# EAGLE design signal_interface_opamp_buffer (EAGLE 6.5.0)
Signal Interfacing Board
AUTHOR: Pasakorn Tiwatthanont; REV: 1
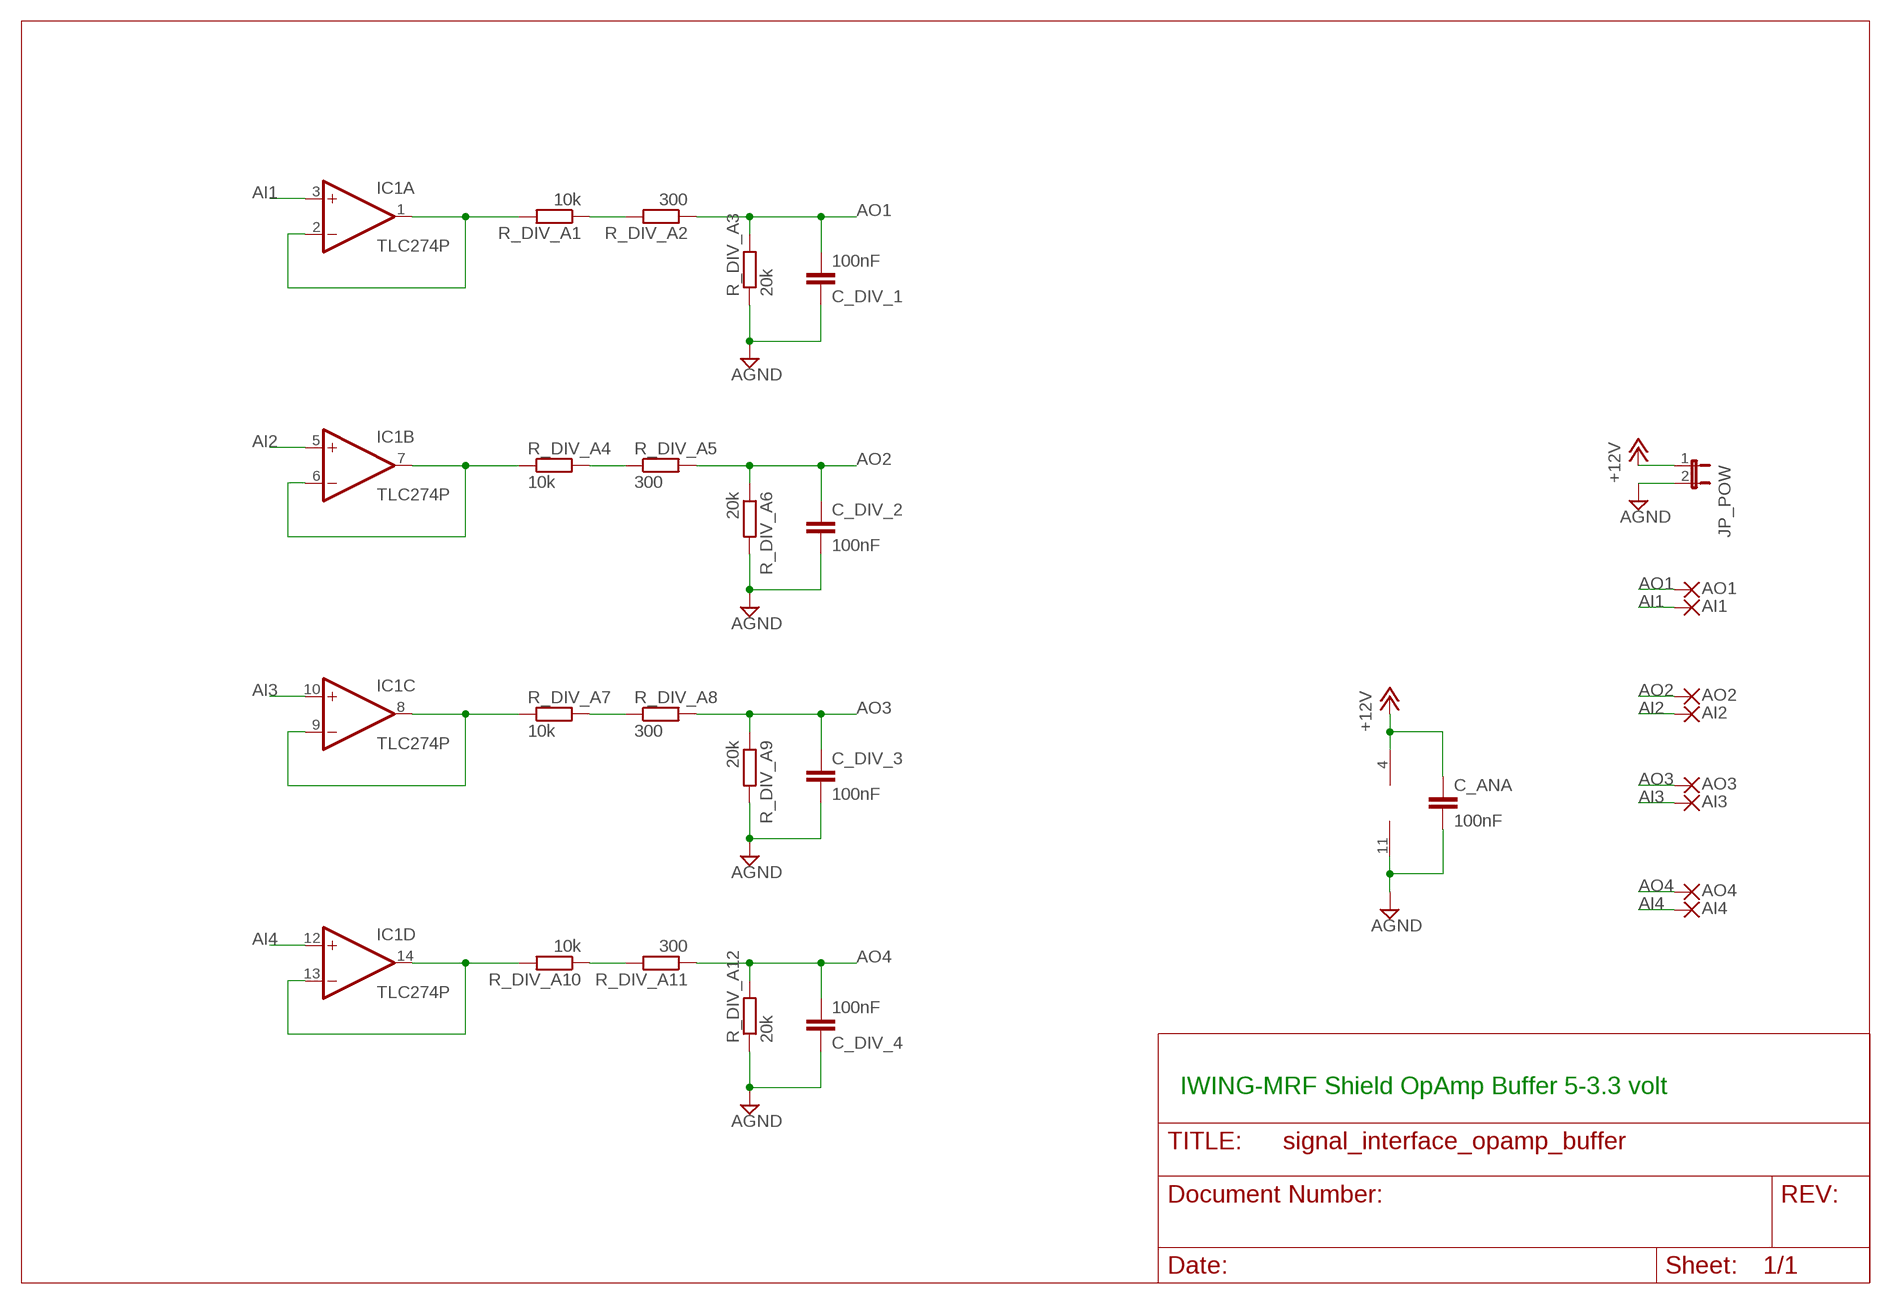
[diagram p0: schematic, sheet 1]

## Parts
AI1  WIREPADSMD1,27-254  [SMD1,27-2,54]
AI2  WIREPADSMD1,27-254  [SMD1,27-2,54]
AI3  WIREPADSMD1,27-254  [SMD1,27-2,54]
AI4  WIREPADSMD1,27-254  [SMD1,27-2,54]
AO1  WIREPADSMD1,27-254  [SMD1,27-2,54]
AO2  WIREPADSMD1,27-254  [SMD1,27-2,54]
AO3  WIREPADSMD1,27-254  [SMD1,27-2,54]
AO4  WIREPADSMD1,27-254  [SMD1,27-2,54]
C_ANA  100nF  RCL_C-EU050-025X075  [RCL_C050-025X075]
C_DIV_1  100nF  RCL_C-EU050-025X075  [RCL_C050-025X075]
C_DIV_2  100nF  RCL_C-EU050-025X075  [RCL_C050-025X075]
C_DIV_3  100nF  RCL_C-EU050-025X075  [RCL_C050-025X075]
C_DIV_4  100nF  RCL_C-EU050-025X075  [RCL_C050-025X075]
IC1  TLC274P  [DIL14]
JP_POW  JUMPER-2PTH  [1X02]
R_DIV_A1  10k  R-EU_0204/2V  [0204V]
R_DIV_A2  300  R-EU_0204/2V  [0204V]
R_DIV_A3  20k  R-EU_0204/2V  [0204V]
R_DIV_A4  10k  R-EU_0204/2V  [0204V]
R_DIV_A5  300  R-EU_0204/2V  [0204V]
R_DIV_A6  20k  R-EU_0204/2V  [0204V]
R_DIV_A7  10k  R-EU_0204/2V  [0204V]
R_DIV_A8  300  R-EU_0204/2V  [0204V]
R_DIV_A9  20k  R-EU_0204/2V  [0204V]
R_DIV_A10  10k  R-EU_0204/2V  [0204V]
R_DIV_A11  300  R-EU_0204/2V  [0204V]
R_DIV_A12  20k  R-EU_0204/2V  [0204V]

## Nets
+12V: C_ANA.1 IC1.4(P:V+) JP_POW.1
AGND: C_ANA.2 C_DIV_1.1 C_DIV_2.2 C_DIV_3.2 C_DIV_4.1 IC1.11(P:V-) JP_POW.2 R_DIV_A3.1 R_DIV_A6.2 R_DIV_A9.2 R_DIV_A12.1
AI1: AI1.1(P) IC1.3(A:+IN)
AI2: AI2.1(P) IC1.5(B:+IN)
AI3: AI3.1(P) IC1.10(C:+IN)
AI4: AI4.1(P) IC1.12(D:+IN)
AO1: AO1.1(P) C_DIV_1.2 R_DIV_A2.1 R_DIV_A3.2
AO2: AO2.1(P) C_DIV_2.1 R_DIV_A5.2 R_DIV_A6.1
AO3: AO3.1(P) C_DIV_3.1 R_DIV_A8.2 R_DIV_A9.1
AO4: AO4.1(P) C_DIV_4.2 R_DIV_A11.1 R_DIV_A12.2
N$1: IC1.1(A:OUT) IC1.2(A:-IN) R_DIV_A1.2
N$2: R_DIV_A4.2 R_DIV_A5.1
N$3: R_DIV_A1.1 R_DIV_A2.2
N$4: IC1.6(B:-IN) IC1.7(B:OUT) R_DIV_A4.1
N$5: R_DIV_A7.2 R_DIV_A8.1
N$6: IC1.8(C:OUT) IC1.9(C:-IN) R_DIV_A7.1
N$7: R_DIV_A10.1 R_DIV_A11.2
N$8: IC1.13(D:-IN) IC1.14(D:OUT) R_DIV_A10.2

## Notes on the sheet
- IWING-MRF Shield OpAmp Buffer 5-3.3 volt

## Library data of the parts
AI1-AI4 AO1-AO4 = wirepad:WIREPAD: Wire PAD connect wire on PCB
C_ANA C_DIV_1-C_DIV_4 = ipas:RCL_C-EU: CAPACITOR, European symbol
IC1 = linear:TLC274: OP AMP
JP_POW = SparkFun-Passives:JUMPER-2: Jumper Basic 0.1" spaced jumper. Use with breakaway headers.
R_DIV_A1-R_DIV_A12 = rcl:R-EU_: RESISTOR, European symbol

## Net classes
0 default: width 0.254 mm
1 power: width 0.406 mm, clearance 0.203 mm

## Board
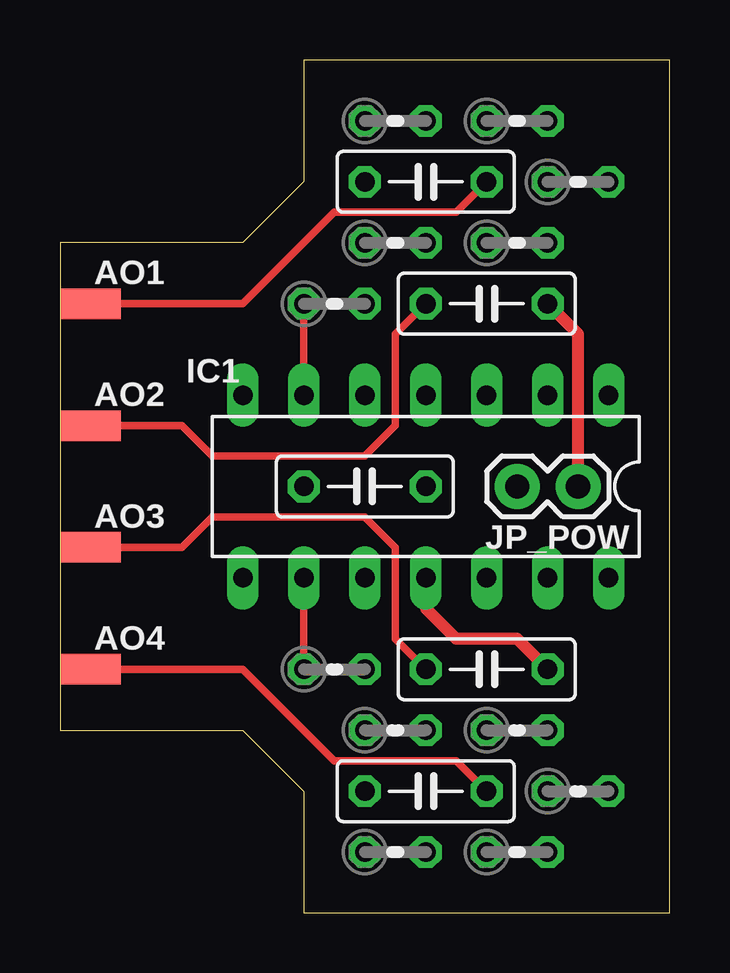
[diagram p1: board, top side]
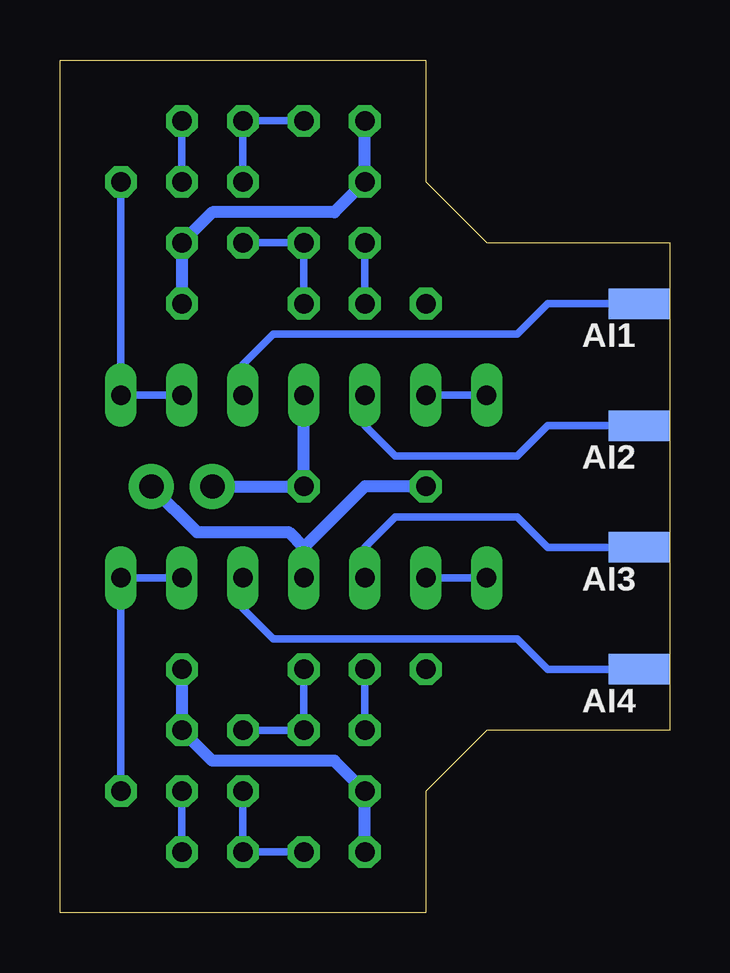
[diagram p2: board, bottom side, seen from below]

Size 25.4 x 35.56 mm. Coordinates in mm from the lower left corner, seen from the top.
Outline: 0,7.62 7.62,7.62 10.16,5.08 10.16,0 25.4,0 25.4,35.56 10.16,35.56 10.16,30.48 7.62,27.94 0,27.94 0,7.62
Copper layers (1*16): Top 0.035mm / dielectric 1.5mm / Bottom 0.035mm
Design rules "default *": minimum track width 12mil, minimum drill 24mil, track to track 12mil, track to pad 12mil, pad to pad 12mil, via to via 12mil, smd to smd 8mil, copper to edge 40mil, drill to drill 8mil, minimum pad ring 10mil, minimum via ring 8mil, stop-mask expansion 4mil, vias tented up to drill 0mil, thermal gap 10mil

### Footprints (pad centres in the part's own frame; a part is rotated, then mirrored left to right if it is on the bottom)
SMD1,27-2,54 = smd 1.27 x 2.54: 1 0,0
RCL_C050-025X075 = drill 0.813 octagon: 1 -2.54,0; 2 2.54,0
DIL14 = drill 0.813 long: 1 -7.62,-3.81; 2 -5.08,-3.81; 3 -2.54,-3.81; 4 0,-3.81; 5 2.54,-3.81; 6 5.08,-3.81; 7 7.62,-3.81; 8 7.62,3.81; 9 5.08,3.81; 10 2.54,3.81; 11 0,3.81; 12 -2.54,3.81; 13 -5.08,3.81; 14 -7.62,3.81
1X02 = drill 1.016 pad 1.88: 1 0,0; 2 2.54,0
0204V = drill 0.813 octagon: 1 -1.27,0; 2 1.27,0

### Placement (x,y rotation side)
AI1  1.27,25.4 90 bottom
AI2  1.27,20.32 90 bottom
AI3  1.27,15.24 90 bottom
AI4  1.27,10.16 90 bottom
AO1  1.27,25.4 270 top
AO2  1.27,20.32 270 top
AO3  1.27,15.24 270 top
AO4  1.27,10.16 270 top
C_ANA  12.7,17.78 180 top
C_DIV_1  15.24,30.48 0 top
C_DIV_2  17.78,25.4 0 top
C_DIV_3  17.78,10.16 0 top
C_DIV_4  15.24,5.08 0 top
IC1  15.24,17.78 180 top
JP_POW  19.05,17.78 0 top
R_DIV_A1  21.59,30.48 0 top
R_DIV_A2  19.05,33.02 0 top
R_DIV_A3  13.97,33.02 0 top
R_DIV_A4  11.43,25.4 0 top
R_DIV_A5  13.97,27.94 0 top
R_DIV_A6  19.05,27.94 0 top
R_DIV_A7  11.43,10.16 0 top
R_DIV_A8  13.97,7.62 0 top
R_DIV_A9  19.05,7.62 0 top
R_DIV_A10  21.59,5.08 0 top
R_DIV_A11  19.05,2.54 0 top
R_DIV_A12  13.97,2.54 0 top

### Tracks (layer width: path | path; a pad name or v marks a point on that pad's centre or on a via)
+12V
  Bottom 0.508: IC1.4 C_ANA.1 JP_POW.1
AGND
  Top 0.508: C_DIV_3.2 19.05,11.43 16.51,11.43 15.24,12.7 IC1.11 | JP_POW.2 21.59,24.13 C_DIV_2.2
  Bottom 0.508: C_DIV_2.2 R_DIV_A6.2 19.05,29.21 13.97,29.21 C_DIV_1.1 R_DIV_A3.1 | C_DIV_3.2 R_DIV_A9.2 19.05,6.35 13.97,6.35 C_DIV_4.1 R_DIV_A12.1 | C_ANA.2 12.7,17.78 15.24,15.24 | 15.24,15.24 IC1.11 | JP_POW.2 19.69,15.88 15.88,15.88 15.24,15.24
AI1
  Bottom 0.305: AI1.1 5.08,25.4 6.35,24.13 16.51,24.13 17.78,22.86 IC1.3
AI2
  Bottom 0.305: AI2.1 5.08,20.32 6.35,19.05 11.43,19.05 12.7,20.32 IC1.5
AI3
  Bottom 0.305: AI3.1 5.08,15.24 6.35,16.51 11.43,16.51 12.7,15.24 IC1.10
AI4
  Bottom 0.305: AI4.1 5.08,10.16 6.35,11.43 16.51,11.43 17.78,12.7 IC1.12
AO1
  Top 0.305: AO1.1 7.62,25.4 11.43,29.21 16.51,29.21 C_DIV_1.2
  Bottom 0.305: R_DIV_A3.2 R_DIV_A2.1 C_DIV_1.2
AO2
  Top 0.305: AO2.1 5.08,20.32 6.35,19.05 12.7,19.05 13.97,20.32 13.97,24.13 C_DIV_2.1
  Bottom 0.305: R_DIV_A6.1 R_DIV_A5.2 C_DIV_2.1
AO3
  Top 0.305: AO3.1 5.08,15.24 6.35,16.51 12.7,16.51 13.97,15.24 13.97,11.43 C_DIV_3.1
  Bottom 0.305: C_DIV_3.1 R_DIV_A8.2 R_DIV_A9.1
AO4
  Top 0.305: AO4.1 7.62,10.16 11.43,6.35 16.51,6.35 C_DIV_4.2
  Bottom 0.305: R_DIV_A12.2 R_DIV_A11.1 C_DIV_4.2
N$1
  Bottom 0.305: IC1.2 IC1.1 R_DIV_A1.2
N$2
  Bottom 0.305: R_DIV_A5.1 R_DIV_A4.2
N$3
  Bottom 0.305: R_DIV_A2.2 R_DIV_A1.1
N$4
  Top 0.305: IC1.6 R_DIV_A4.1
  Bottom 0.305: IC1.7 IC1.6
N$5
  Bottom 0.305: R_DIV_A8.1 R_DIV_A7.2
N$6
  Top 0.305: IC1.9 R_DIV_A7.1
  Bottom 0.305: IC1.8 IC1.9
N$7
  Bottom 0.305: R_DIV_A11.2 R_DIV_A10.1
N$8
  Bottom 0.305: IC1.13 IC1.14 R_DIV_A10.2